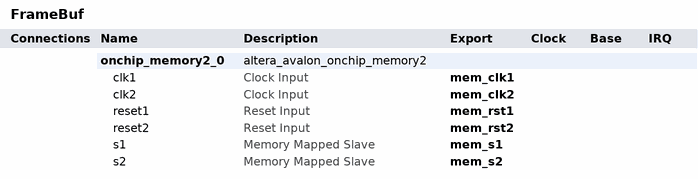
[diagram p0: system contents]
# Platform Designer (Qsys) system FrameBuf, Cyclone 10 LP 10CL010YE144I7G
# Parameters at their usual value, and those the tool derives, are not listed.
package require -exact qsys 18.1
create_system FrameBuf
set_project_property DEVICE_FAMILY {Cyclone 10 LP}
set_project_property DEVICE 10CL010YE144I7G

add_instance onchip_memory2_0 altera_avalon_onchip_memory2 18.1
set_instance_parameter_value onchip_memory2_0 dataWidth 16
set_instance_parameter_value onchip_memory2_0 dualPort true
set_instance_parameter_value onchip_memory2_0 initMemContent true
set_instance_parameter_value onchip_memory2_0 initializationFileName onchip_mem.hex
set_instance_parameter_value onchip_memory2_0 memorySize 16384
set_instance_parameter_value onchip_memory2_0 resetrequest_enabled false

# exported interfaces
add_interface mem_clk1 clock sink
set_interface_property mem_clk1 EXPORT_OF onchip_memory2_0.clk1
add_interface mem_clk2 clock sink
set_interface_property mem_clk2 EXPORT_OF onchip_memory2_0.clk2
add_interface mem_rst1 reset sink
set_interface_property mem_rst1 EXPORT_OF onchip_memory2_0.reset1
add_interface mem_rst2 reset sink
set_interface_property mem_rst2 EXPORT_OF onchip_memory2_0.reset2
add_interface mem_s1 avalon slave
set_interface_property mem_s1 EXPORT_OF onchip_memory2_0.s1
add_interface mem_s2 avalon slave
set_interface_property mem_s2 EXPORT_OF onchip_memory2_0.s2

set_interconnect_requirement {$system} qsys_mm.clockCrossingAdapter HANDSHAKE
set_interconnect_requirement {$system} qsys_mm.enableEccProtection FALSE
set_interconnect_requirement {$system} qsys_mm.insertDefaultSlave FALSE
set_interconnect_requirement {$system} qsys_mm.maxAdditionalLatency 1

save_system FrameBuf.qsys
